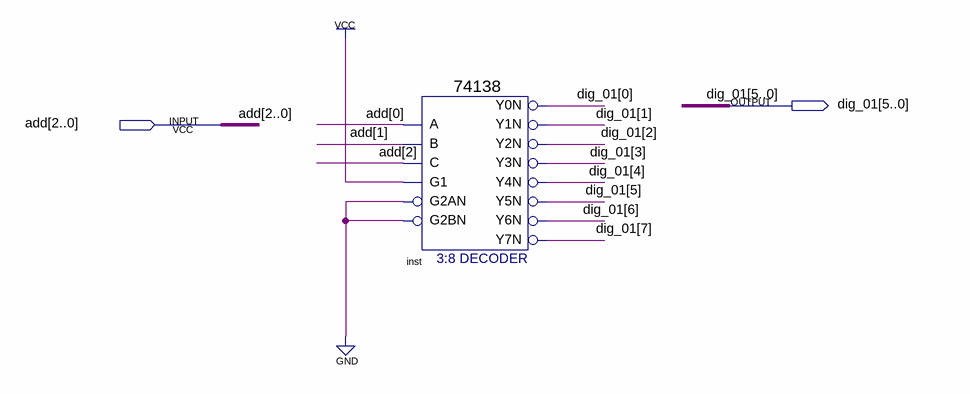
[diagram p0: schematic sheet]
// Quartus schematic dig_select.bdf as structural Verilog: 1 symbols, 2 pins
module dig_select (
  input  [2:0] add,
  output [7:0] dig_01
);

  \74138  inst (
    .A(add[0]), .B(add[1]), .G1(1'b1), .C(add[2]), .G2AN(1'b0), .G2BN(1'b0), .Y0N(dig_01[0]),
    .Y1N(dig_01[1]), .Y2N(dig_01[2]), .Y3N(dig_01[3]), .Y4N(dig_01[4]), .Y5N(dig_01[5]), .Y6N(dig_01[6]),
    .Y7N(dig_01[7]));
endmodule
